# Altium project Buck_main.PrjPcb
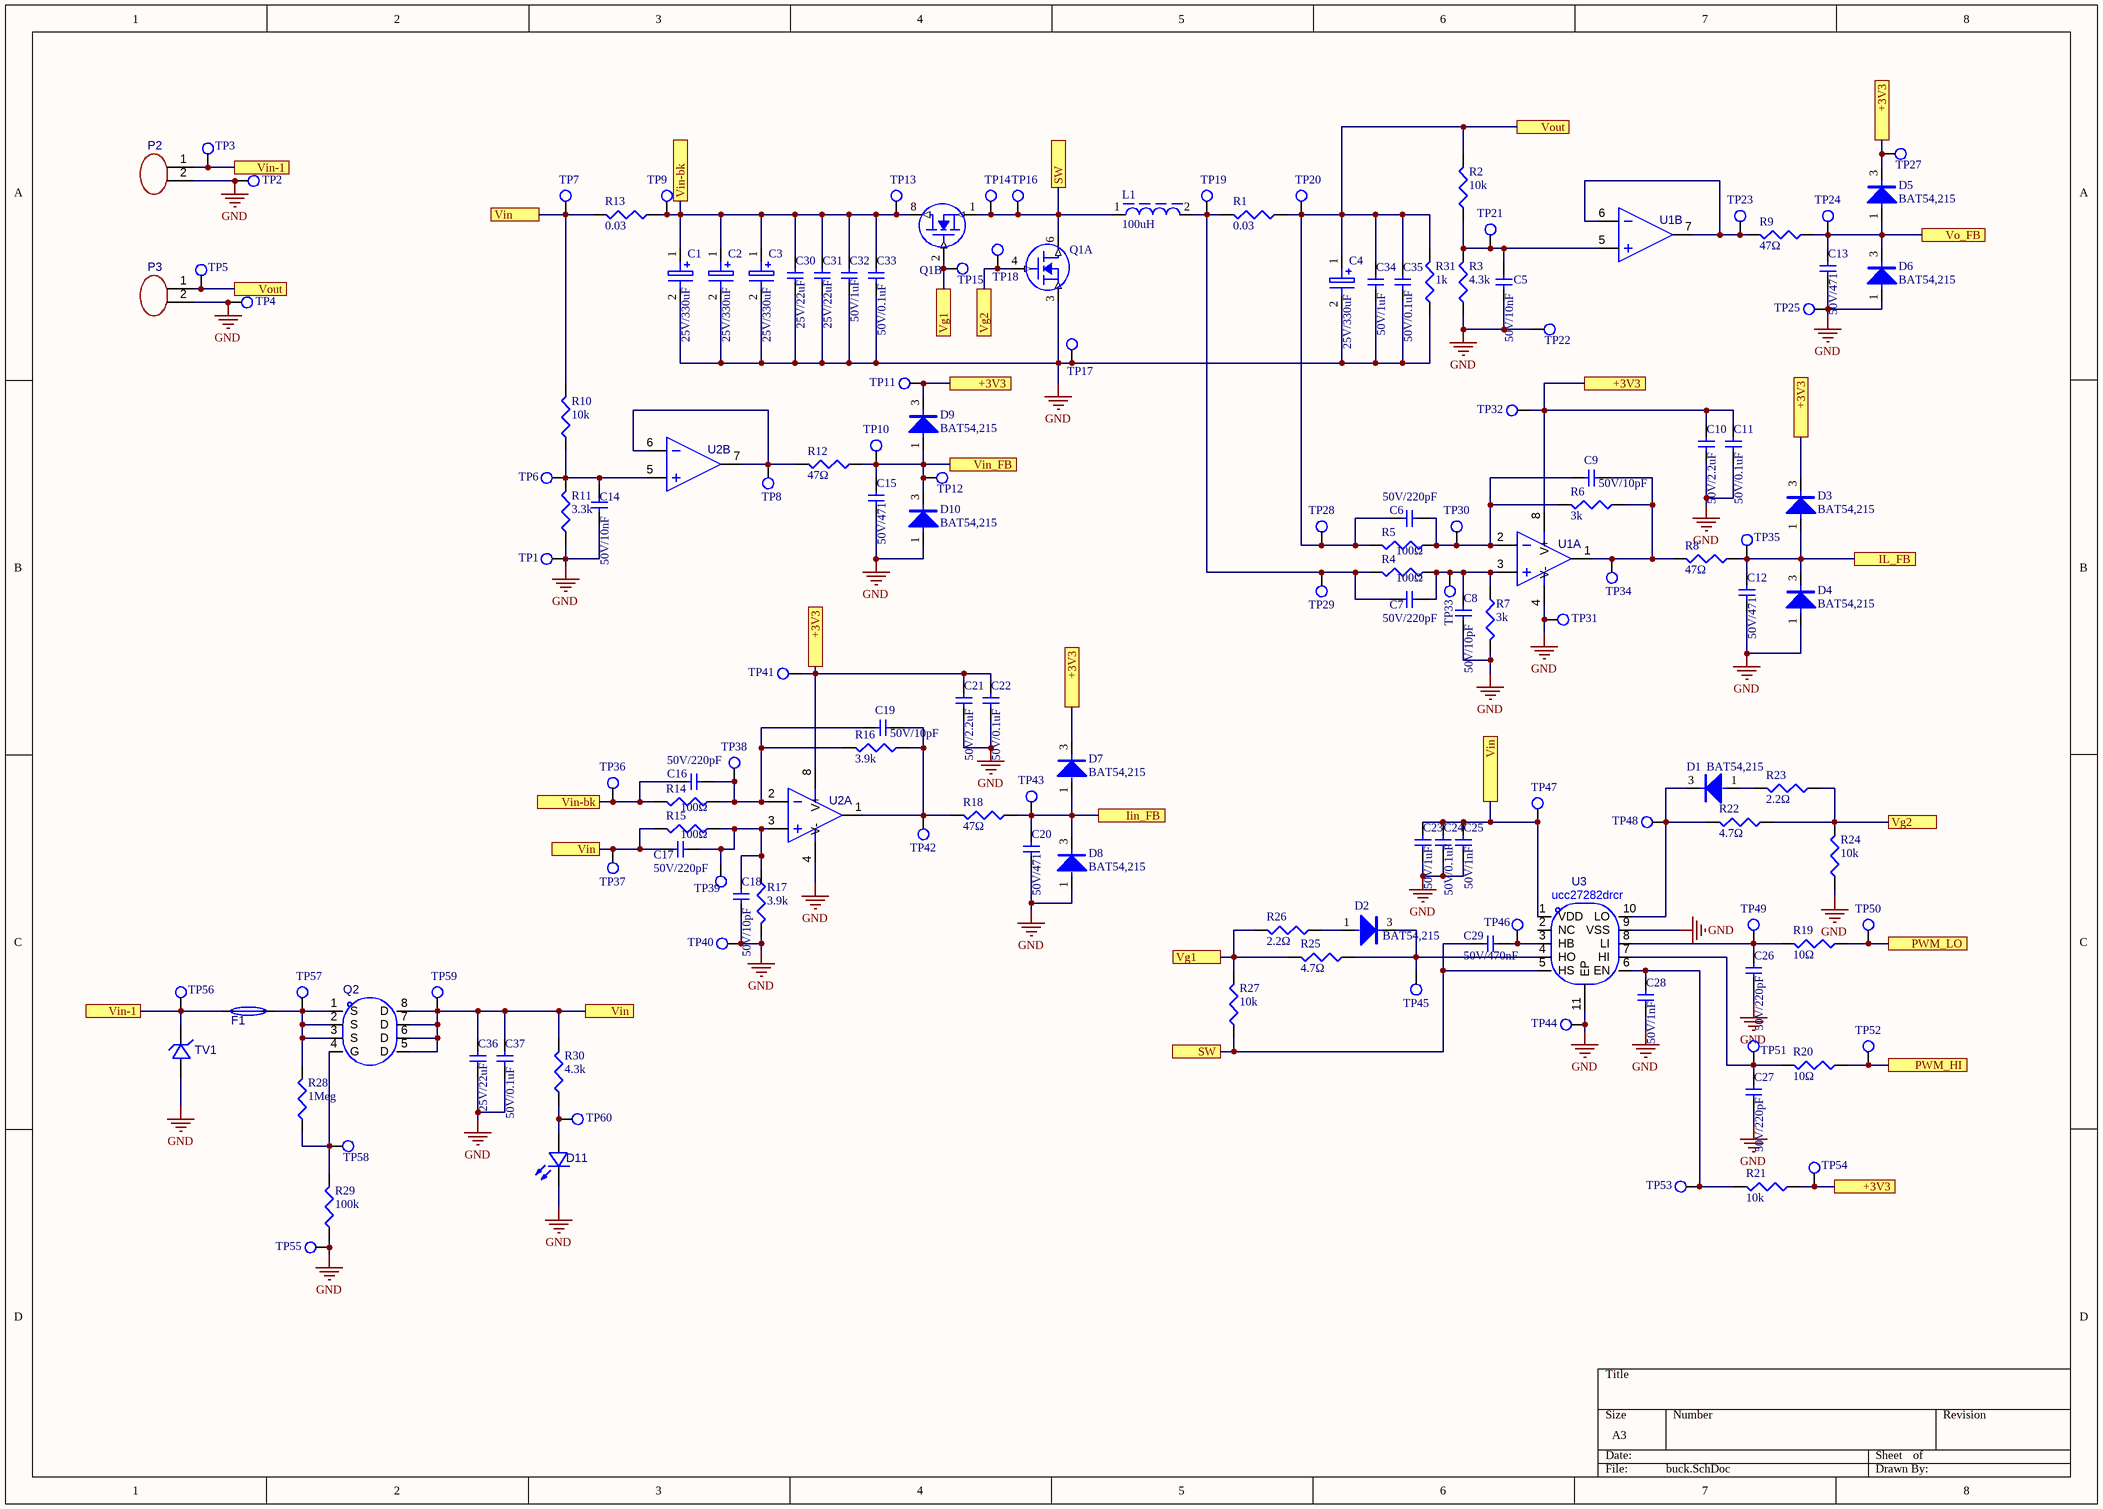
[diagram p0: buck.SchDoc]
2 sheets, 163 parts. Net scope: flat (ports and power ports of the same name join across sheets).
Sheets:
  buck.SchDoc
  2.SchDoc

## Sheet buck.SchDoc
size A3; SheetNumber: 1; SheetTotal: 2

### Parts
C1  25V/330uF  [CAP-TH_BD8.0-P3.50-D0.6-FD]
C2  25V/330uF  [CAP-TH_BD8.0-P3.50-D0.6-FD]
C3  25V/330uF  [CAP-TH_BD8.0-P3.50-D0.6-FD]
C4  25V/330uF  [CAP-TH_BD8.0-P3.50-D0.6-FD]
C5  50V/10nF  [C0603]
C6  50V/220pF  [C0603]
C7  50V/220pF  [C0603]
C8  50V/10pF  [C0603]
C9  50V/10pF  [C0603]
C10  50V/2.2uF  [C0805]
C11  50V/0.1uF  [C0603]
C12  50V/471  [C0603]
C13  50V/471  [C0603]
C14  50V/10nF  [C0603]
C15  50V/471  [C0603]
C16  50V/220pF  [C0603]
C17  50V/220pF  [C0603]
C18  50V/10pF  [C0603]
C19  50V/10pF  [C0603]
C20  50V/471  [C0603]
C21  50V/2.2uF  [C0805]
C22  50V/0.1uF  [C0603]
C23  50V/1uF  [C0603]
C24  50V/0.1uF  [C0603]
C25  50V/1nF  [C0603]
C26  50V/220pF  [C0603]
C27  50V/220pF  [C0603]
C28  50V/1nF  [C0603]
C29  50V/470nF  [C0603]
C30  25V/22uF  [C0805]
C31  25V/22uF  [C0805]
C32  50V/1uF  [C0603]
C33  50V/0.1uF  [C0603]
C34  50V/1uF  [C0603]
C35  50V/0.1uF  [C0603]
C36  25V/22uF  [C0805]
C37  50V/0.1uF  [C0603]
D1  BAT54,215  [SOT-23_L2.9-W1.3-P1.90-LS2.4-BR]
D2  BAT54,215  [SOT-23_L2.9-W1.3-P1.90-LS2.4-BR]
D3  BAT54,215  [SOT-23_L2.9-W1.3-P1.90-LS2.4-BR]
D4  BAT54,215  [SOT-23_L2.9-W1.3-P1.90-LS2.4-BR]
D5  BAT54,215  [SOT-23_L2.9-W1.3-P1.90-LS2.4-BR]
D6  BAT54,215  [SOT-23_L2.9-W1.3-P1.90-LS2.4-BR]
D7  BAT54,215  [SOT-23_L2.9-W1.3-P1.90-LS2.4-BR]
D8  BAT54,215  [SOT-23_L2.9-W1.3-P1.90-LS2.4-BR]
D9  BAT54,215  [SOT-23_L2.9-W1.3-P1.90-LS2.4-BR]
D10  BAT54,215  [SOT-23_L2.9-W1.3-P1.90-LS2.4-BR]
D11  ncd0805c1  [LED0805-RD]  (value not drawn)
F1  bsmd1206c-1400t  [F1206]  (value not drawn)
L1  100uH  [IND-SMD_L13.5-W12.6]
P2  wj500v-5.08-2p  [CONN-TH_2P-P5.00_WJ500V-5.08-2P]  (value not drawn)
P3  wj500v-5.08-2p  [CONN-TH_2P-P5.00_WJ500V-5.08-2P]  (value not drawn)
Q1  NCE6005AS  [SOP-8_L4.9-W3.9-P1.27-LS6.0-BL-2mos]  (value not drawn)  (parts A,B of 2)
Q2  ao4407a_c2841482  [SOP-8_L5.0-W4.0-P1.27-LS6.0-BL]  (value not drawn)
R1  0.03  [R0805]
R2  10k  [R0603]
R3  4.3k  [R0603]
R4  100Ω  [R0603]
R5  100Ω  [R0603]
R6  3k  [R0603]
R7  3k  [R0603]
R8  47Ω  [R0603]
R9  47Ω  [R0603]
R10  10k  [R0603]
R11  3.3k  [R0603]
R12  47Ω  [R0603]
R13  0.03  [R0805]
R14  100Ω  [R0603]
R15  100Ω  [R0603]
R16  3.9k  [R0603]
R17  3.9k  [R0603]
R18  47Ω  [R0603]
R19  10Ω  [R0603]
R20  10Ω  [R0603]
R21  10k  [R0603]
R22  4.7Ω  [R0603]
R23  2.2Ω  [R0603]
R24  10k  [R0603]
R25  4.7Ω  [R0603]
R26  2.2Ω  [R0603]
R27  10k  [R0603]
R28  1Meg  [R0603]
R29  100k  [R0603]
R30  4.3k  [R0603]
R31  1k  [R1206]
TP1  TP-pad0.8  [PAD0.8/1.6]  (value not drawn)
TP2  TP-pad0.8  [PAD0.8/1.6]  (value not drawn)
TP3  TP-pad0.8  [PAD0.8/1.6]  (value not drawn)
TP4  TP-pad0.8  [PAD0.8/1.6]  (value not drawn)
TP5  TP-pad0.8  [PAD0.8/1.6]  (value not drawn)
TP6  TEST POINT  [TP-1.5]  (value not drawn)
TP7  TP-pad0.8  [PAD0.8/1.6]  (value not drawn)
TP8  TEST POINT  [TP-1.5]  (value not drawn)
TP9  TEST POINT  [TP-1.5]  (value not drawn)
TP10  TEST POINT  [TP-1.5]  (value not drawn)
TP11  TEST POINT  [TP-1.5]  (value not drawn)
TP12  TEST POINT  [TP-1.5]  (value not drawn)
TP13  TP-pad0.8  [PAD0.8/1.6]  (value not drawn)
TP14  TP-pad0.8  [PAD0.8/1.6]  (value not drawn)
TP15  TP-pad0.8  [PAD0.8/1.6]  (value not drawn)
TP16  TP-pad0.8  [PAD0.8/1.6]  (value not drawn)
TP17  TP-pad0.8  [PAD0.8/1.6]  (value not drawn)
TP18  TP-pad0.8  [PAD0.8/1.6]  (value not drawn)
TP19  TP-pad0.8  [PAD0.8/1.6]  (value not drawn)
TP20  TP-pad0.8  [PAD0.8/1.6]  (value not drawn)
TP21  TEST POINT  [TP-1.5]  (value not drawn)
TP22  TP-pad0.8  [PAD0.8/1.6]  (value not drawn)
TP23  TEST POINT  [TP-1.5]  (value not drawn)
TP24  TEST POINT  [TP-1.5]  (value not drawn)
TP25  TP-pad0.8  [PAD0.8/1.6]  (value not drawn)
TP27  TP-pad0.8  [PAD0.8/1.6]  (value not drawn)
TP28  TEST POINT  [TP-1.5]  (value not drawn)
TP29  TEST POINT  [TP-1.5]  (value not drawn)
TP30  TEST POINT  [TP-1.5]  (value not drawn)
TP31  TP-pad0.8  [PAD0.8/1.6]  (value not drawn)
TP32  TP-pad0.8  [PAD0.8/1.6]  (value not drawn)
TP33  TEST POINT  [TP-1.5]  (value not drawn)
TP34  TEST POINT  [TP-1.5]  (value not drawn)
TP35  TEST POINT  [TP-1.5]  (value not drawn)
TP36  TEST POINT  [TP-1.5]  (value not drawn)
TP37  TEST POINT  [TP-1.5]  (value not drawn)
TP38  TEST POINT  [TP-1.5]  (value not drawn)
TP39  TEST POINT  [TP-1.5]  (value not drawn)
TP40  TP-pad0.8  [PAD0.8/1.6]  (value not drawn)
TP41  TP-pad0.8  [PAD0.8/1.6]  (value not drawn)
TP42  TEST POINT  [TP-1.5]  (value not drawn)
TP43  TEST POINT  [TP-1.5]  (value not drawn)
TP44  TP-pad0.8  [PAD0.8/1.6]  (value not drawn)
TP45  TP-pad0.8  [PAD0.8/1.6]  (value not drawn)
TP46  TP-pad0.8  [PAD0.8/1.6]  (value not drawn)
TP47  TP-pad0.8  [PAD0.8/1.6]  (value not drawn)
TP48  TP-pad0.8  [PAD0.8/1.6]  (value not drawn)
TP49  TP-pad0.8  [PAD0.8/1.6]  (value not drawn)
TP50  TP-pad0.8  [PAD0.8/1.6]  (value not drawn)
TP51  TP-pad0.8  [PAD0.8/1.6]  (value not drawn)
TP52  TP-pad0.8  [PAD0.8/1.6]  (value not drawn)
TP53  TP-pad0.8  [PAD0.8/1.6]  (value not drawn)
TP54  TP-pad0.8  [PAD0.8/1.6]  (value not drawn)
TP55  TP-pad0.8  [PAD0.8/1.6]  (value not drawn)
TP56  TP-pad0.8  [PAD0.8/1.6]  (value not drawn)
TP57  TP-pad0.8  [PAD0.8/1.6]  (value not drawn)
TP58  TEST POINT  [TP-1.5]  (value not drawn)
TP59  TP-pad0.8  [PAD0.8/1.6]  (value not drawn)
TP60  TEST POINT  [TP-1.5]  (value not drawn)
TV1  smbj15a_c83846  [SMB_L4.6-W3.6-LS5.3-RD]  (value not drawn)
U1  tlv9062idgkr  [VSSOP-8_L3.0-W3.0-P0.65-LS4.9-BL]  (value not drawn)  (parts A,B of 2)
U2  tlv9062idgkr  [VSSOP-8_L3.0-W3.0-P0.65-LS4.9-BL]  (value not drawn)  (parts A,B of 2)
U3  ucc27282drcr  [VSON-10_L3.0-W3.0-P0.50-TL-EP]

### Ports
+3V3, Iin_FB, IL_FB, PWM_HI, PWM_LO, SW, Vg1, Vg2, Vin, Vin-1, Vin-bk, Vin_FB, Vo_FB, Vout

### Nets
GND: C1.2 C2.2 C3.2 C4.2 C5.2 C8.2 C10.2 C11.2 C12.2 C13.2 C14.2 C15.2 C18.2 C20.2 C21.2 C22.2 C23.2 C24.2 C25.2 C26.2 C27.2 C28.2 C30.2 C31.2 C32.2 C33.2 C34.2 C35.2 C36.2 C37.2 D4.1(A) D6.1(A) D8.1(A) D10.1(A) D11.1(K) P2.2 P3.2 Q1.3(S) R3.1 R7.2 R11.1 R17.2 R24.1 R29.1 R31.1 TP1.1 TP2.1 TP4.1 TP17.1 TP22.1 TP25.1 TP31.1 TP40.1 TP44.1 TP55.1 TV1.2 U1.4(V-) U2.4(V-) U3.9(VSS) U3.11(EP)
+3V3: C10.1 C11.1 C21.1 C22.1 D3.3(K) D5.3(K) D7.3(K) D9.3(K) R21.1 TP11.1 TP27.1 TP32.1 TP41.1 TP54.1 U1.8(V+) U2.8(V+) ; port +3V3
Iin_FB: C20.1 D7.1(A) D8.3(K) R18.1 TP43.1 ; port Iin_FB
IL_FB: C12.1 D3.1(A) D4.3(K) R8.1 TP35.1 ; port IL_FB
PWM_HI: R20.1 TP52.1 ; port PWM_HI
PWM_LO: R19.1 TP50.1 ; port PWM_LO
SW: C29.1 L1.1 Q1.1(S) Q1.6(D) R27.1 TP14.1 TP16.1 U3.5(HS) ; port SW
Vg1: Q1.2(G) R25.2 R26.2 R27.2 TP15.1 ; port Vg1
Vg2: Q1.4(G) R22.1 R23.1 R24.2 TP18.1 ; port Vg2
Vin: C17.1 C23.1 C24.1 C25.1 C36.1 C37.1 Q2.5(D) Q2.6(D) Q2.7(D) Q2.8(D) R10.2 R13.2 R15.2 R30.2 TP7.1 TP37.1 TP47.1 TP59.1 U3.1(VDD) ; port Vin
Vin-1: F1.1 P2.1 TP3.1 TP56.1 TV1.1 ; port Vin-1
Vin-bk: C1.1 C2.1 C3.1 C16.1 C30.1 C31.1 C32.1 C33.1 Q1.8(D) R13.1 R14.2 TP9.1 TP13.1 TP36.1 ; port Vin-bk
Vin_FB: C15.1 D9.1(A) D10.3(K) R12.1 TP10.1 TP12.1 ; port Vin_FB
Vo_FB: C13.1 D5.1(A) D6.3(K) R9.1 TP24.1 ; port Vo_FB
Vout: C4.1 C6.1 C34.1 C35.1 P3.1 R1.1 R2.2 R5.2 R31.2 TP5.1 TP20.1 TP28.1 ; port Vout
NetC5_1: C5.1 R2.1 R3.2 TP21.1 U1.5(IN2+)
NetC6_2: C6.2 C9.1 R5.1 R6.2 TP30.1 U1.2(IN1-)
NetC7_1: C7.1 L1.2 R1.2 R4.2 TP19.1 TP29.1
NetC7_2: C7.2 C8.1 R4.1 R7.1 TP33.1 U1.3(IN1+)
NetC9_2: C9.2 R6.1 R8.2 TP34.1 U1.1(OUT1)
NetC14_1: C14.1 R10.1 R11.2 TP6.1 U2.5(IN2+)
NetC16_2: C16.2 C19.1 R14.1 R16.2 TP38.1 U2.2(IN1-)
NetC17_2: C17.2 C18.1 R15.1 R17.1 TP39.1 U2.3(IN1+)
NetC19_2: C19.2 R16.1 R18.2 TP42.1 U2.1(OUT1)
NetC26_1: C26.1 R19.2 TP49.1 U3.8(LI)
NetC27_1: C27.1 R20.2 TP51.1 U3.7(HI)
NetC28_1: C28.1 R21.2 TP53.1 U3.6(EN)
NetC29_2: C29.2 TP46.1 U3.3(HB)
NetD1_1: D1.1(A) R23.2
NetD1_3: D1.3(K) R22.2 TP48.1 U3.10(LO)
NetD2_1: D2.1(A) R26.1
NetD2_3: D2.3(K) R25.1 TP45.1 U3.4(HO)
NetD11_2: D11.2(A) R30.1 TP60.1
NetF1_2: F1.2 Q2.1(S) Q2.2(S) Q2.3(S) R28.2 TP57.1
NetQ2_4: Q2.4(G) R28.1 R29.2 TP58.1
NetR9_2: R9.2 TP23.1 U1.6(IN2-) U1.7(OUT2)
NetR12_2: R12.2 TP8.1 U2.6(IN2-) U2.7(OUT2)

Not connected (* = marked no-connect by the designer): U3 2(NC)

### Library data of the parts
C1-C4 = 电解电容25V/330uF: 25V/330uF,ERS1EM331F12OT,艾华,插件,D8xL12mm,irms=850mA,esr=0.086,
C5 C14 = C0603-50V/10nF: 0603,50V/10nF
C6 C7 C16 C17 C26 C27 = C0603-50V/220pF: 0603,50V/220pF
C8 C9 C18 C19 = C0603-50V/10pF: 0603,50V/10pF
C10 C21 = C0805-50V/2.2uF: 0805,50V/2.2uF,
C11 C22 C24 C33 C35 C37 = C0603-50V/104: 0603,50V/104
C12 C13 C15 C20 = C0603-50V/471: 0603,50V/471,
C23 C32 C34 = C0603-50V/1uF: 0603,50V/1uF
C25 C28 = C0603-50V/1nF: 0603,50V/1nF
C29 = C0603-50V/470nF: 0603,50V/470nF
C30 C31 C36 = C0805-25V/22uF: 0805,25V/22uF,
D1-D10 = 二极管-BAT54,215: BAT54,215,安世,SOT-23,肖特基二极管
D11 = ncd0805c1: 灯头类型:-;发光颜色:黄绿色;正向压降(Vf):1.6V~2.6V;功率:65mW;正向电流:25mA;波长:565nm~578nm;二极管配置:独立二极管;透镜颜色:-;色温:-;发光强度:55mcd;发光角度:130°;载带方式:-;工作温度:-30℃~+85℃;; Manufacturer: 国星光电; Symbol: FC-2012GHK-570A08; AddInBom: yes; ModelId: b1c5ed7a4f6e46d3bc6f6cc7c20f3fea; ModelTransform: 79.527,49.2125,0,0,0,0,0,0,0; Illumination Color: 黄绿色; Power(Watts): 65mW; Forward Current: 25mA; Peak Wavelength: 576nm; Diode Configuration: 独立二极管; Luminous Intensity: 55mcd; Viewing Angle: 130°; LCSC Part Name: 片式发光二极管; SupplierPart: C84257; ManufacturerPart: NCD0805C1; Supplier Footprint: 0805; JLCPCB Part Class: Extended Part; Datasheet: https://item.szlcsc.com/datasheet/NCD0805C1/85426.html; Supplier: LCSC; ConvertToPcb: yes; FootprintName: LED0805-RD; ModelName: LED0805-RD; Lamp Holder Type: -; Voltage - Forward(Vf): 1.6V~2.6V; Wavelength - Dominant: 565nm~578nm; Lens Color: -; Color Temperature: -; Mounting Style: -; Operating Temperature: -30℃~+85℃
F1 = bsmd1206c-1400t: 类型:贴片式保险丝;额定电流:4A;额定电压 (AC):72V;额定电压:72V;分断能力:50A;; Manufacturer: BHFUSE(佰宏); AddInBom: yes; ModelId: f1628daad26847a79b887277a2bc8541; ModelName: F1206_L3.2-W1.7-H0.6; ModelTransform: 125.984,66.929,0,0,0,0,0,0,0; Type: 贴片式保险丝; Current Rating: 4A; Voltage Rating (AC): 72V; Interrupt Rating: 50A; Symbol: BSMD1206C-1400T; LCSC Part Name: 1206 4A 72V 一次性 慢速熔断; SupplierPart: C41367227; ManufacturerPart: BSMD1206C-1400T; Supplier Footprint: 1206; JLCPCB Part Class: Extended Part; Datasheet: https://item.szlcsc.com/datasheet/BSMD1206C-1400T/43118980.html; Supplier: LCSC; ConvertToPcb: yes; FootprintName: F1206; Voltage Rating (DC): 72V; Operating Temperature: -55℃~+150℃; Length: 3.2mm; Width: 1.6mm
L1 = 电感-100uH/5A: 100uH/5.5A,SMD,XR1365-101M,SMD,13.5x12.6mm,XR(祥如),i=5.5A,isat=7.5A
P2 P3 = wj500v-5.08-2p: 结构:1x2P;间距:5.08mm;颜色:绿色;安装类型:直插;排数:1;每排PIN数:2;额定电流:18A;额定电压:250V;线规 - AWG:14~30;线规 - 平方毫米:2.5;工作温度:-40℃~+105℃;; Manufacturer: KANGNEX(康奈克斯电气); Symbol: WJ500V-5.08-2P-14-00A; AddInBom: yes; ModelId: 0f4a503c8d3b4ae19ed61267f5e9a1d7; ModelTransform: 423.621,393.7,0,0,0,0,-11.811,19.685,-137.795; Number of Positions or Pins: 1x2P; Pitch: 5.08mm; Number of PINs Per Row: 2; Screw Specification: M2.5; Current Rating: 18A; Voltage Rating (Max): 250V; Wire Gauge - AWG: 14~30; Wire Gauge - mm2: 2.5; LCSC Part Name: 1x2P 5.08mm 直插 排数:1 每排P数:2; SupplierPart: C8465; ManufacturerPart: WJ500V-5.08-2P; Supplier Footprint: 插件,P=5.08mm; JLCPCB Part Class: Extended Part; Datasheet: https://item.szlcsc.com/datasheet/WJ500V-5.08-2P/8959.html; Supplier: LCSC; ConvertToPcb: yes; FootprintName: CONN-TH_2P-P5.00_WJ500V-5.08-2P; ModelName: CONN-TH_2P-P5.00_WJ500V-5.08-2P; Color: 绿色; Mounting Type: 直插; Number of Pins: 2P; Number of Rows: 1; Operating Temperature: -40℃~+105℃
Q1 = MOS管-60V/5A: NCE6005AS,60V/5A,Rdson=35m,新洁能,2个N沟道
Q2 = ao4407a_c2841482: 数量:1个P沟道;漏源电压(Vdss):30V;连续漏极电流(Id):14A;导通电阻(RDS(on)):9.5mΩ@10V；14.7mΩ@4.5V;耗散功率(Pd):3.1W;阈值电压(Vgs(th)):1.8V@250uA;; Manufacturer: UMW(友台半导体); AddInBom: yes; ModelId: a3315c1c78f949e6bb82c6eaca1c53c7; ModelName: SOP-8_L5.0-W4.0-H1.8-LS6.2-P1.27; ModelTransform: 244.094,196.85,0,90,0,0,0,0,0; Number: 1个P沟道; Drain to Source Voltage: 30V; Current - Continuous Drain(Id): 14A; Pd - Power Dissipation: 3.1W; Gate Charge(Qg): 40nC@10V；20nC@4.5V; Input Capacitance(Ciss): 2.05nF; Reverse Transfer Capacitance (Crss@Vds): 300pF; Output Capacitance(Coss): 330pF; Symbol: AO4407A_C2841482; LCSC Part Name: 1个P沟道 耐压:30V 电流:14A; SupplierPart: C2841482; ManufacturerPart: AO4407A; Supplier Footprint: SOP-8; JLCPCB Part Class: Extended Part; Datasheet: https://item.szlcsc.com/datasheet/AO4407A/3024118.html; Supplier: LCSC; ConvertToPcb: yes; FootprintName: SOP-8_L5.0-W4.0-P1.27-LS6.0-BL; RDS(on): 9.5mΩ@10V；14.7mΩ@4.5V; Gate Threshold Voltage (Vgs(th)): 1.8V@250uA; Operating Temperature: -55℃~+150℃
R1 R13 = R0805-0R03: 0805,0.03,RE0805FAR030,捷而瑞
R2 R10 R21 R24 R27 = R0603-10k: 0603,10k
R3 R30 = R0603-4.3k: 0603,4.3k
R4 R5 R14 R15 = R0603-100Ω: 0603,100Ω
R6 R7 = R0603-3k: 0603,3k
R8 R9 R12 R18 = R0603-47Ω: 0603,47Ω
R11 = R0603-3.3k: 0603,3.3k
R16 R17 = R0603-3.9k: 0603,3.9k
R19 R20 = R0603-10Ω: 0603,10Ω
R22 R25 = R0603-4.7Ω: 0603,4.7Ω
R23 R26 = R0603-2.2Ω: 0603,2.2Ω
R28 = R0603-1Meg: 0603,1Meg
R29 = R0603-100k: 0603,100k
R31 = R1206-1k: 1206,1k
TV1 = smbj15a_c83846: 极性:单向;反向截止电压(Vrwm):15V;钳位电压:24.4V;峰值脉冲电流(Ipp):24.6A;峰值脉冲功率(Ppp):600W;击穿电压(VBR):16.7V;; Manufacturer: Littelfuse(美国力特); AddInBom: yes; ModelId: 5e8926c661484ff2a35b83e5ae62aeb9; ModelTransform: 212.598,141.732,0,0,0,0,0,0,0; Polarity: 单向; Reverse Stand-Off Voltage (Vrwm): 15V; Clamping Voltage: 24.4V; Peak Pulse Current (Ipp): 24.6A; Peak Pulse Power Dissipation (Ppp): 600W; Voltage - Breakdown: 16.7V; Reverse Leakage Current (Ir): 1uA; level of protection: IEC 61000-4-4；IEC 61000-4-2; Symbol: SMBJ15A_C83846; LCSC Part Name: 单向TVS 15V截止 峰值浪涌电流：24.6A; SupplierPart: C83846; ManufacturerPart: SMBJ15A; Supplier Footprint: DO-214AA; JLCPCB Part Class: Extended Part; Datasheet: https://item.szlcsc.com/datasheet/SMBJ15A/85013.html; Supplier: LCSC; ConvertToPcb: yes; FootprintName: SMB_L4.6-W3.6-LS5.3-RD; ModelName: SMB_L4.6-W3.6-LS5.3-RD; Operating Temperature: -65℃~+150℃; Type: TVS
U1 U2 = tlv9062idgkr: 放大器数:2;轨到轨:轨到轨输入,轨到轨输出;增益带宽积(GBW):10MHz;输入失调电压(Vos):1.6mV;压摆率(SR):55V/us;输入偏置电流(Ib):0.5pA;; Manufacturer: TI(德州仪器); AddInBom: yes; ModelId: fe8ada2663e64b00b932016623def703; ModelName: VSSOP-8_L3.0-W3.0-H1.1-LS4.9-P0.65; ModelTransform: 197.34433,118.11,0,90,0,0,0,0.0005,0; Number of Channels: 2; Maximum Power Supply Range (Vdd-Vss): 9V; Gain Bandwidth Product: 10MHz; Vos - Input Offset Voltage: 1.6mV; Input Offset Voltage Drift(Vos TC): 530nV/℃; Slew Rate: 55V/us; Ib - Input Bias Current: 0.5pA; Input Offset Current(Ios): 0.05pA; Input Voltage Noise Density: 10nV/√Hz@1kHz; Common Mode Rejection Ratio(CMRR): 103dB; Quiescent Current: 538uA; Output Current: 50mA; Single supply: 1.8V~5.5V; Symbol: TLV9062IDGKR; LCSC Part Name: 适用于成本敏感型系统的10MHz、轨到轨输入输出（RRIO）CMOS运算放大器; SupplierPart: C398356; ManufacturerPart: TLV9062IDGKR; Supplier Footprint: VSSOP-8; JLCPCB Part Class: Extended Part; Datasheet: https://www.ti.com/cn/lit/gpn/tlv9061; Supplier: LCSC; ConvertToPcb: yes; FootprintName: VSSOP-8_L3.0-W3.0-P0.65-LS4.9-BL; Rail to Rail: 轨到轨输入,轨到轨输出; Input offset current drift(Ios TC): -; Operating Temperature: -40℃~+125℃; Dual Supply: -
U3 = ucc27282drcr: 驱动配置:半桥;负载类型:MOSFET;驱动通道数:2;灌电流(IOL):3A;拉电流(IOH):3A;工作电压:5.5V~16V;上升时间(tr):12ns;下降时间(tf):10ns;; Manufacturer: TI(德州仪器); AddInBom: yes; ModelId: 300e49eb54114194a2c77d97940ae074; ModelName: VSON-10_L3.0-W3.0-H0.6-P0.50; ModelTransform: 118.8974,118.8974,0,270,0,0,-0.001,0.002,0; Driven Configuration: 半桥; Load Type: MOSFET; Number of Drivers: 2; Current - Output Low(IOL): 3A; Rise Time: 12ns; Fall Time: 10ns; Propagation Delay tpLH: 16ns; Input Logic Level - High: 1.9V~2.4V; Input Logic Level - Low: 900mV~1.3V; Quiescent Current(Iq): 300uA; Symbol: UCC27282DRCR; LCSC Part Name: 具有跨导保护和低开关损耗的3A 120V半桥驱动器; SupplierPart: C2677035; ManufacturerPart: UCC27282DRCR; Supplier Footprint: VSON-10-EP(3x3); JLCPCB Part Class: Extended Part; Datasheet: https://www.ti.com/cn/lit/ds/symlink/ucc27282.pdf; Supplier: LCSC; ConvertToPcb: yes; FootprintName: VSON-10_L3.0-W3.0-P0.50-TL-EP; Current - Output High(IOH): 3A; Voltage - Supply: 5.5V~16V; Propagation Delay tpHL: 16ns; Features: 使能关断；内置自举二极管；交错导通保护; Operating Temperature: -40℃~+140℃

## Sheet 2.SchDoc
size A3; SheetNumber: 2; SheetTotal: 2
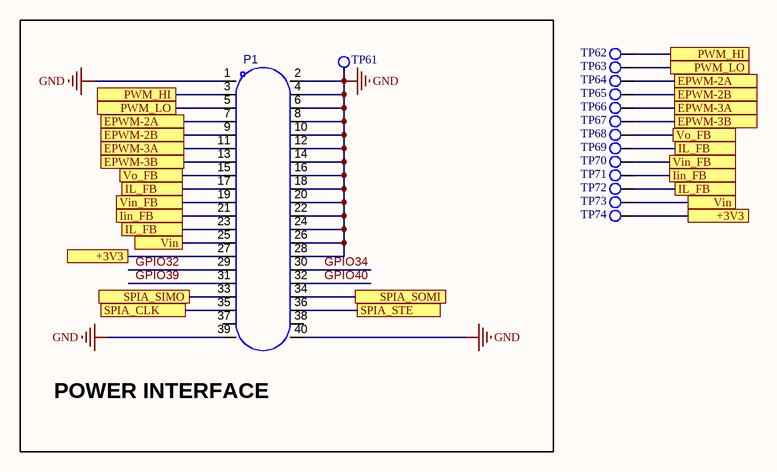
[diagram p1: 2.SchDoc]

### Parts
P1  zx-pm2.54-2-20py  [HDR-TH_40P-P2.54-V-F-R2-C20-S2.54]  (value not drawn)
TP61  TP-pad0.8  [PAD0.8/1.6]  (value not drawn)
TP62  TP-pad0.8  [PAD0.8/1.6]  (value not drawn)
TP63  TP-pad0.8  [PAD0.8/1.6]  (value not drawn)
TP64  TP-pad0.8  [PAD0.8/1.6]  (value not drawn)
TP65  TP-pad0.8  [PAD0.8/1.6]  (value not drawn)
TP66  TP-pad0.8  [PAD0.8/1.6]  (value not drawn)
TP67  TP-pad0.8  [PAD0.8/1.6]  (value not drawn)
TP68  TEST POINT  [TP-1.5]  (value not drawn)
TP69  TEST POINT  [TP-1.5]  (value not drawn)
TP70  TEST POINT  [TP-1.5]  (value not drawn)
TP71  TEST POINT  [TP-1.5]  (value not drawn)
TP72  TEST POINT  [TP-1.5]  (value not drawn)
TP73  TEST POINT  [TP-1.5]  (value not drawn)
TP74  TEST POINT  [TP-1.5]  (value not drawn)

### Blocks framed on the sheet
POWER INTERFACE: P1 TP61

### Ports
+3V3, EPWM-2A, EPWM-2B, EPWM-3A, EPWM-3B, Iin_FB, IL_FB, PWM_HI, PWM_LO, SPIA_CLK, SPIA_SIMO, SPIA_SOMI, SPIA_STE, Vin, Vin_FB, Vo_FB

### Nets
GND: P1.1 P1.2 P1.4 P1.6 P1.8 P1.10 P1.12 P1.14 P1.16 P1.18 P1.20 P1.22 P1.24 P1.26 P1.28 P1.39 P1.40 TP61.1
+3V3: P1.27 TP74.1 ; port +3V3
EPWM-2A: P1.7 TP64.1 ; port EPWM-2A
EPWM-2B: P1.9 TP65.1 ; port EPWM-2B
EPWM-3A: P1.11 TP66.1 ; port EPWM-3A
EPWM-3B: P1.13 TP67.1 ; port EPWM-3B
GPIO32: P1.29
GPIO34: P1.30
GPIO39: P1.31
GPIO40: P1.32
Iin_FB: P1.21 TP71.1 ; port Iin_FB
IL_FB: P1.17 P1.23 TP69.1 TP72.1 ; port IL_FB
PWM_HI: P1.3 TP62.1 ; port PWM_HI
PWM_LO: P1.5 TP63.1 ; port PWM_LO
SPIA_CLK: P1.35 ; port SPIA_CLK
SPIA_SIMO: P1.33 ; port SPIA_SIMO
SPIA_SOMI: P1.34 ; port SPIA_SOMI
SPIA_STE: P1.36 ; port SPIA_STE
Vin: P1.25 TP73.1 ; port Vin
Vin_FB: P1.19 TP70.1 ; port Vin_FB
Vo_FB: P1.15 TP68.1 ; port Vo_FB

Not connected (* = marked no-connect by the designer): P1 37 38

### Library data of the parts
P1 = zx-pm2.54-2-20py: 插孔结构:2x20P;间距:2.54mm;行距:2.54mm;圆孔/方孔:方孔;安装方式:直插;排数:双排;总孔位数:40P;额定电流:3A;额定电压:-;插孔方向:顶部;塑高:8.5mm;触头材质:黄铜;触头镀层:金;工作温度:-40℃~+105℃;; Manufacturer: Megastar(兆星); AddInBom: yes; ModelId: 6c85b3860eb24e43a9d123684eb6d3ee; ModelName: HDR-TH_40P-P2.54-F-LI-2X20P; ModelTransform: 2015.783,196.85,0,0,0,0,0,0,-125.984; Holes Structure: 2x20P; Pitch: 2.54mm; Circular Hole / Square Hole: 方孔; Number of Positions: 40P; Current Rating: 3A; Holes Direction: 顶部; PIN Length: 3.2mm; Symbol: ZX-PM2.54-2-20PY; LCSC Part Name: 2x20P 间距:2.54mm 直插; SupplierPart: C7499354; ManufacturerPart: ZX-PM2.54-2-20PY; Supplier Footprint: 插件,P=2.54mm; JLCPCB Part Class: Extended Part; Datasheet: https://item.szlcsc.com/datasheet/ZX-PM2.54-2-20PY/8574015.html; Supplier: LCSC; ConvertToPcb: yes; FootprintName: HDR-TH_40P-P2.54-V-F-R2-C20-S2.54; Row Spacing: 2.54mm; Mounting Type: 直插; Number of Rows: 双排; Voltage Rating (Max): -; Insulation Height: 8.5mm; Contact Material: 黄铜; Contact Plating: 金; Operating Temperature: -40℃~+105℃

## Nets that join several sheets
GND: buck (60 pins), 2 (18 pins)
+3V3: buck (16 pins), 2 (P1.27 TP74.1)
Iin_FB: buck (5 pins), 2 (P1.21 TP71.1)
IL_FB: buck (5 pins), 2 (P1.17 P1.23 TP69.1 TP72.1)
PWM_HI: buck (R20.1 TP52.1), 2 (P1.3 TP62.1)
PWM_LO: buck (R19.1 TP50.1), 2 (P1.5 TP63.1)
Vin: buck (19 pins), 2 (P1.25 TP73.1)
Vin_FB: buck (6 pins), 2 (P1.19 TP70.1)
Vo_FB: buck (5 pins), 2 (P1.15 TP68.1)